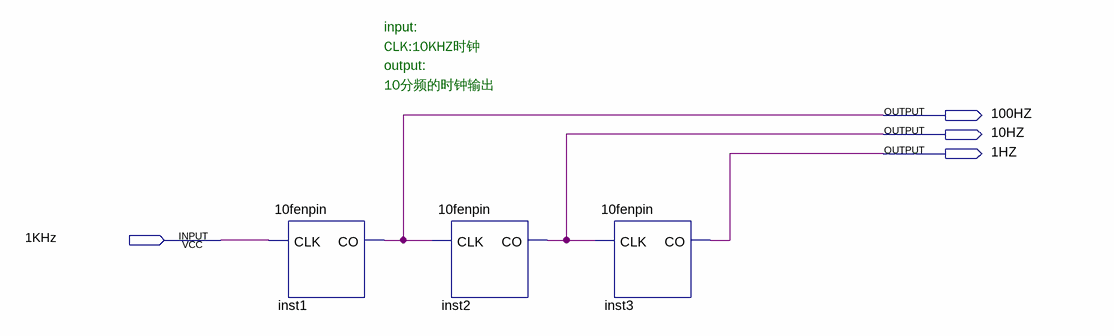
[diagram p0: schematic sheet]
// Quartus schematic timescale.bdf as structural Verilog: 3 symbols, 4 pins
module timescale (
  input  \1KHz ,
  output \100HZ ,
  output \10HZ ,
  output \1HZ 
);

  \10fenpin  inst1 (.CLK(\1KHz ), .CO(\100HZ ));
  \10fenpin  inst2 (.CLK(\100HZ ), .CO(\10HZ ));
  \10fenpin  inst3 (.CLK(\10HZ ), .CO(\1HZ ));

  // Notes on the sheet:
  //   input:
  //   CLK:10KHZ时钟
  //   output:
  //   10分频的时钟输出
endmodule
